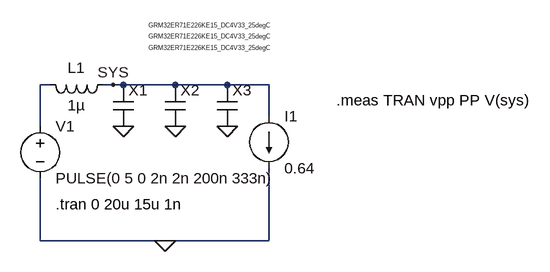
[diagram p0: schematic Draft1.asc]
Draft1.asc, the LTspice schematic file:
Version 4.1
SHEET 1 880 680
WIRE 112 48 96 48
WIRE 208 48 192 48
WIRE 224 48 208 48
WIRE 304 48 224 48
WIRE 384 48 304 48
WIRE 448 48 384 48
WIRE 448 96 448 48
WIRE 96 112 96 48
WIRE 96 288 96 192
WIRE 288 288 96 288
WIRE 448 288 448 176
WIRE 448 288 288 288
FLAG 224 112 0
FLAG 304 112 0
FLAG 384 112 0
FLAG 288 288 0
FLAG 208 48 SYS
SYMBOL voltage 96 96 R0
WINDOW 123 0 0 Left 0
WINDOW 39 0 0 Left 0
SYMATTR InstName V1
SYMATTR Value PULSE(0 5 0 2n 2n 200n 333n)
SYMBOL cap 208 48 R0
WINDOW 3 55 -57 Left 0
SYMATTR InstName X1
SYMATTR Value GRM32ER71E226KE15_DC4V33_25degC
SYMATTR Prefix X
SYMBOL cap 288 48 R0
WINDOW 3 -25 -92 Left 0
SYMATTR InstName X2
SYMATTR Value GRM32ER71E226KE15_DC4V33_25degC
SYMATTR Prefix X
SYMBOL cap 368 48 R0
WINDOW 3 -105 -75 Left 0
SYMATTR InstName X3
SYMATTR Value GRM32ER71E226KE15_DC4V33_25degC
SYMATTR Prefix X
SYMBOL ind 208 32 R90
WINDOW 0 5 56 VBottom 2
WINDOW 3 32 56 VTop 2
SYMATTR InstName L1
SYMATTR Value 1µ
SYMATTR SpiceLine Ipk=2 Rser=96m
SYMBOL current 448 96 R0
WINDOW 123 0 0 Left 0
WINDOW 39 0 0 Left 0
SYMATTR InstName I1
SYMATTR Value 0.64
TEXT 120 232 Left 2 !.tran 0 20u 15u 1n
TEXT 552 72 Left 2 !.meas TRAN vpp PP V(sys)

The netlist it stands for:
* Draft1.asc
V1 N001 0 PULSE(0 5 0 2n 2n 200n 333n)
X§X1 SYS 0 GRM32ER71E226KE15_DC4V33_25degC  ; pins A B
X§X2 SYS 0 GRM32ER71E226KE15_DC4V33_25degC  ; pins A B
X§X3 SYS 0 GRM32ER71E226KE15_DC4V33_25degC  ; pins A B
L1 SYS N001 1µ Ipk=2 Rser=96m
I1 SYS 0 0.64
.tran 0 20u 15u 1n
.meas TRAN vpp PP V(sys)
.backanno
.end